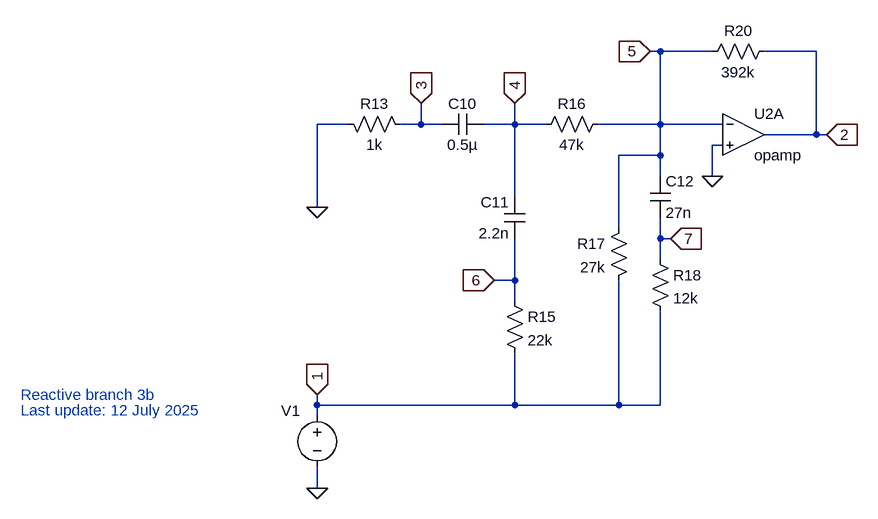
[diagram p0: schematic Reactive_branch_3b.asc]
Reactive_branch_3b.asc, the LTspice schematic file:
Version 4
SHEET 1 4496 5064
WIRE 640 2432 624 2432
WIRE 720 2432 640 2432
WIRE 880 2432 800 2432
WIRE 160 2544 112 2544
WIRE 272 2544 272 2512
WIRE 272 2544 240 2544
WIRE 304 2544 272 2544
WIRE 416 2544 416 2512
WIRE 416 2544 368 2544
WIRE 464 2544 416 2544
WIRE 640 2544 640 2432
WIRE 640 2544 544 2544
WIRE 736 2544 640 2544
WIRE 880 2560 880 2432
WIRE 880 2560 800 2560
WIRE 896 2560 880 2560
WIRE 736 2576 720 2576
WIRE 640 2592 640 2544
WIRE 640 2592 576 2592
WIRE 640 2624 640 2592
WIRE 720 2624 720 2576
WIRE 416 2656 416 2544
WIRE 112 2672 112 2544
WIRE 576 2704 576 2592
WIRE 640 2720 640 2688
WIRE 656 2720 640 2720
WIRE 640 2752 640 2720
WIRE 416 2784 416 2720
WIRE 416 2784 384 2784
WIRE 416 2816 416 2784
WIRE 112 2976 112 2960
WIRE 416 2976 416 2896
WIRE 416 2976 112 2976
WIRE 576 2976 576 2784
WIRE 576 2976 416 2976
WIRE 640 2976 640 2832
WIRE 640 2976 576 2976
WIRE 112 2992 112 2976
WIRE 112 3104 112 3072
FLAG 624 2432 5
IOPIN 624 2432 In
FLAG 416 2512 4
IOPIN 416 2512 In
FLAG 384 2784 6
IOPIN 384 2784 In
FLAG 656 2720 7
IOPIN 656 2720 In
FLAG 112 2960 1
IOPIN 112 2960 In
FLAG 112 3104 0
FLAG 112 2672 0
FLAG 272 2512 3
IOPIN 272 2512 In
FLAG 896 2560 2
IOPIN 896 2560 In
FLAG 720 2624 0
SYMBOL res 256 2560 M270
WINDOW 0 32 56 VTop 2
WINDOW 3 0 56 VBottom 2
SYMATTR InstName R13
SYMATTR Value 1k
SYMBOL cap 432 2656 M0
SYMATTR InstName C11
SYMATTR Value 2.2n
SYMBOL res 400 2800 R0
SYMATTR InstName R15
SYMATTR Value 22k
SYMBOL res 592 2688 M0
SYMATTR InstName R17
SYMATTR Value 27k
SYMBOL res 624 2736 R0
SYMATTR InstName R18
SYMATTR Value 12k
SYMBOL cap 624 2624 R0
SYMATTR InstName C12
SYMATTR Value 27n
SYMBOL res 560 2528 R90
WINDOW 0 0 56 VBottom 2
WINDOW 3 32 56 VTop 2
SYMATTR InstName R16
SYMATTR Value 47k
SYMBOL voltage 112 2976 R0
WINDOW 0 -55 9 Left 2
WINDOW 39 0 0 Left 0
WINDOW 3 -55 37 Invisible 2
SYMATTR InstName V1
SYMATTR Value 1
SYMATTR Value2 AC 1 0
SYMBOL cap 368 2528 R90
WINDOW 0 0 32 VBottom 2
WINDOW 3 32 32 VTop 2
SYMATTR InstName C10
SYMATTR Value 0.5µ
SYMBOL res 816 2416 R90
WINDOW 0 0 56 VBottom 2
WINDOW 3 32 56 VTop 2
SYMATTR InstName R20
SYMATTR Value 392k
SYMBOL OpAmps\\opamp 768 2496 R0
SYMATTR InstName U2A
TEXT -344 2960 Left 2 ;Reactive branch 3b
TEXT -344 2984 Left 2 ;Last update: 12 July 2025

The netlist it stands for:
* Reactive_branch_3b.asc
R13 3 0 1k
C11 4 6 2.2n
R15 6 1 22k
R17 5 1 27k
R18 7 1 12k
C12 5 7 27n
R16 5 4 47k
V1 1 0 1 AC 1 0
C10 4 3 0.5µ
R20 2 5 392k
XU2A 5 0 2 opamp Aol=100K GBW=10Meg  ; pins invin noninvin out
* Reactive branch 3b
* Last update: 12 July 2025
.backanno
.end